# EAGLE design home_alarm_revB (EAGLE 9.5.1)
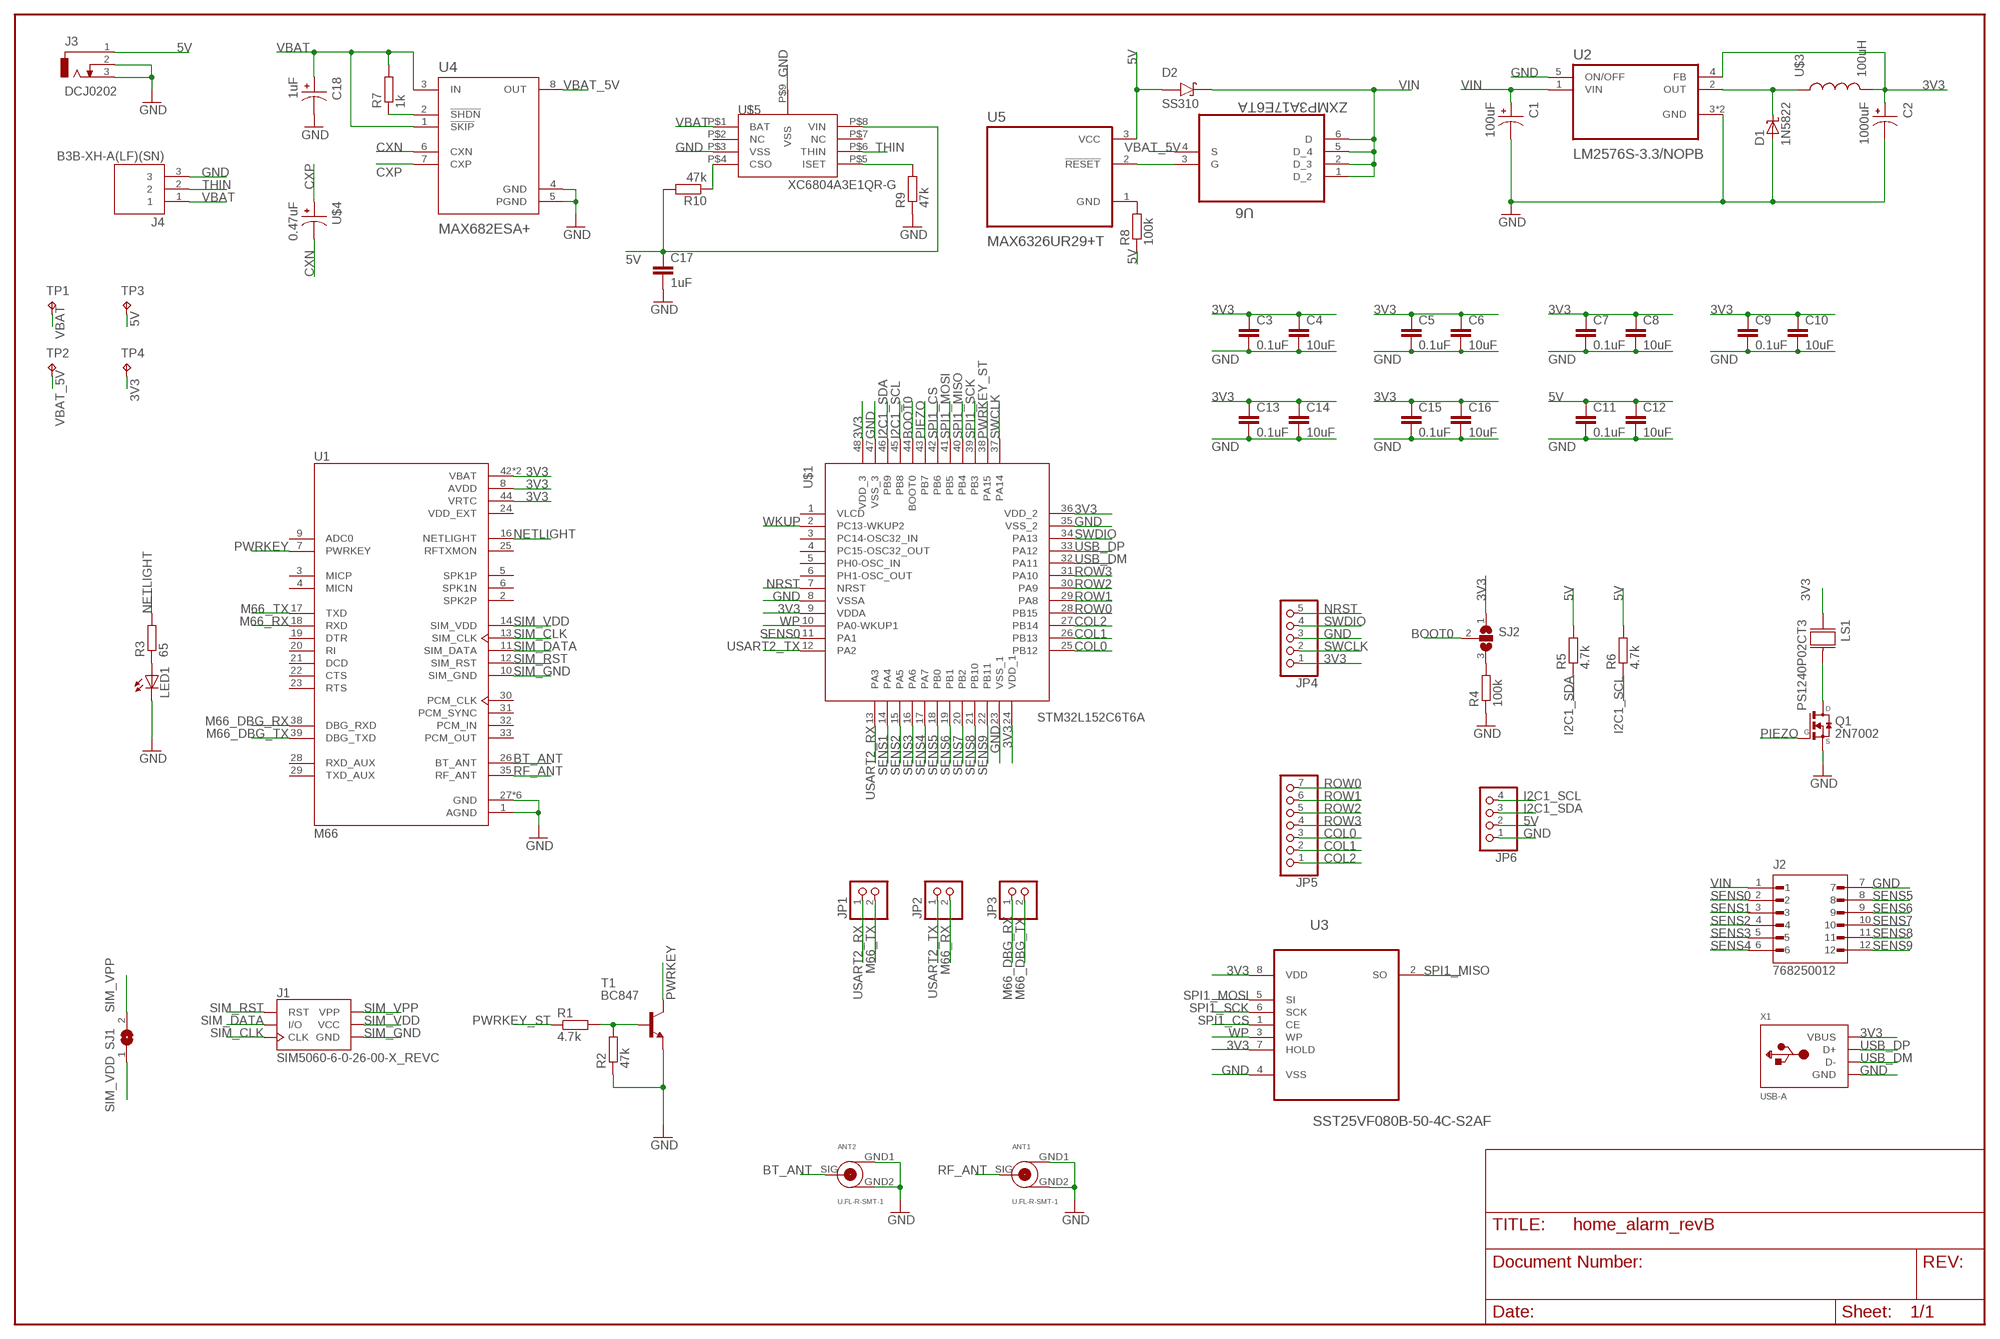
[diagram p0: schematic, sheet 1]

## Parts
ANT1  U.FL-R-SMT-1  [U.FL-R-SMT-1]
ANT2  U.FL-R-SMT-1  [U.FL-R-SMT-1]
C1  100uF  EEEFP1C101AV  [CAP_EEEFP1C101AV]
C2  1000uF  EEEFK1C102SV  [CAP_EEEFK1C102SV]
C3  0.1uF  C-EUC0805  [C0805]
C4  10uF  C-EUC0805  [C0805]
C5  0.1uF  C-EUC0805  [C0805]
C6  10uF  C-EUC0805  [C0805]
C7  0.1uF  C-EUC0805  [C0805]
C8  10uF  C-EUC0805  [C0805]
C9  0.1uF  C-EUC0805  [C0805]
C10  10uF  C-EUC0805  [C0805]
C11  0.1uF  C-EUC0805  [C0805]
C12  10uF  C-EUC0805  [C0805]
C13  0.1uF  C-EUC0805  [C0805]
C14  10uF  C-EUC0805  [C0805]
C15  0.1uF  C-EUC0805  [C0805]
C16  10uF  C-EUC0805  [C0805]
C17  1uF  C-EUC0805  [C0805]
C18  1uF  EEE1HA010NR  [CAP_EEE1HA010NR]
D1  1N5822  [DIOAD2120W130L950D530P]
D2  SS310  [DIOM6859X262N]
J1  SIM5060-6-0-26-00-X_REVC  [GCT_SIM5060-6-0-26-00-X_REVC]
J2  768250012  [MOLEX_768250012]
J3  DCJ0202  [DCJ0202]
J4  B3B-XH-A(LF)(SN)  [JST_B3B-XH-A(LF)(SN)]
JP1  PINHD-1X2  [1X02]
JP2  PINHD-1X2  [1X02]
JP3  PINHD-1X2  [1X02]
JP4  PINHD-1X5  [1X05]
JP5  PINHD-1X7  [1X07]
JP6  PINHD-1X4  [1X04]
LED1  LEDCHIPLED_0603  [CHIPLED_0603]
LS1  PS1240P02CT3  [XDCR_PS1240P02CT3]
Q1  2N7002  [SOT23]
R1  4.7k  R-EU_R0805  [R0805]
R2  47k  R-EU_R0805  [R0805]
R3  65  R-EU_R0805  [R0805]
R4  100k  R-EU_R0805  [R0805]
R5  4.7k  R-EU_R0805  [R0805]
R6  4.7k  R-EU_R0805  [R0805]
R7  1k  R-EU_R0805  [R0805]
R8  100k  R-EU_R0805  [R0805]
R9  47k  R-EU_R0805  [R0805]
R10  47k  R-EU_R0805  [R0805]
SJ1  SJ  [SJ]
SJ2  SJ2W  [SJ_2]
T1  BC847  [SOT23]
TP1  TPB1,27  [B1,27]
TP2  TPB1,27  [B1,27]
TP3  TPB1,27  [B1,27]
TP4  TPB1,27  [B1,27]
U1  M66  [XCVR_M66]
U2  LM2576S-3.3/NOPB  [VREG_TPS79625KTTR]
U3  SST25VF080B-50-4C-S2AF  [SOIC127P790X216-8N]
U4  MAX682ESA+  [SOIC127P600X175-8N]
U5  MAX6326UR29+T  [SOT95P237X112-3N]
U6  ZXMP3A17E6TA  [SOT95P280X145-6N]
U$1  STM32L152C6T6A  [STM32L152C6T6A]
U$3  100uH  MSS1210-104KED  [MSS1210-104KED]
U$4  0.47uF  865230640004  [865230640004]
U$5  XC6804A3E1QR-G  [XC6804A3E1QR-G]
X1  USB-A  [MOLEX_480371000]

## Nets
3V3: C2.1 C3.1 C4.1 C5.1 C6.1 C7.1 C8.1 C9.1 C10.1 C13.1 C14.1 C15.1 C16.1 JP4.1 LS1.1 SJ2.1 TP4.TP U1.8(AVDD) U1.42(VBAT) U1.43(VBAT) U1.44(VRTC) U2.4(FB) U3.7(HOLD) U3.8(VDD) U$1.9(VDDA) U$1.24(VDD_1) U$1.36(VDD_2) U$1.48(VDD_3) U$3.P$2 X1.1(VBUS)
5V: C11.1 C12.1 C17.1 D2.A J3.1 JP6.2 R5.2 R6.2 R8.1 R10.2 TP3.TP U5.3(VCC) U$5.P$8(VIN)
BOOT0: SJ2.2 U$1.44(BOOT0)
BT_ANT: ANT2.SIG U1.26(BT_ANT)
COL0: JP5.3 U$1.25(PB12)
COL1: JP5.2 U$1.26(PB13)
COL2: JP5.1 U$1.27(PB14)
CXN: U4.6(CXN) U$4.2
CXP: U4.7(CXP) U$4.1
GND: ANT1.GND1 ANT1.GND2 ANT2.GND1 ANT2.GND2 C1.2 C2.2 C3.2 C4.2 C5.2 C6.2 C7.2 C8.2 C9.2 C10.2 C11.2 C12.2 C13.2 C14.2 C15.2 C16.2 C17.2 C18.2 D1.A J2.7 J3.2 J3.3 J4.3 JP4.3 JP6.1 LED1.C Q1.2(S) R2.1 R4.1 R9.1 T1.2(E) U1.1(AGND) U1.27(GND) U1.34(GND) U1.36(GND) U1.37(GND) U1.40(GND) U1.41(GND) U2.3(GND) U2.5(ON/OFF) U2.6(GND) U3.4(VSS) U4.4(GND) U4.5(PGND) U$1.8(VSSA) U$1.23(VSS_1) U$1.35(VSS_2) U$1.47(VSS_3) U$5.P$3(VSS) U$5.P$9(VSS) X1.4(GND)
I2C1_SCL: JP6.4 R6.1 U$1.45(PB8)
I2C1_SDA: JP6.3 R5.1 U$1.46(PB9)
M66_DBG_RX: JP3.1 U1.38(DBG_RXD)
M66_DBG_TX: JP3.2 U1.39(DBG_TXD)
M66_RX: JP2.2 U1.18(RXD)
M66_TX: JP1.2 U1.17(TXD)
N$1: LS1.2 Q1.3(D)
N$2: R7.1 U4.2(!SHDN)
N$3: R8.2 U5.1(GND)
N$4: R9.2 U$5.P$5(ISET)
N$5: U5.2(!RESET) U6.3(G)
N$6: R10.1 U$5.P$4(CSO)
N$28: D1.C U2.2(OUT) U$3.P$1
N$29: R1.2 R2.2 T1.1(B)
N$30: LED1.A R3.1
N$33: R4.2 SJ2.3
NETLIGHT: R3.2 U1.16(NETLIGHT)
NRST: JP4.5 U$1.7(NRST)
PIEZO: Q1.1(G) U$1.43(PB7)
PWRKEY: T1.3(C) U1.7(PWRKEY)
PWRKEY_ST: R1.1 U$1.38(PA15)
RF_ANT: ANT1.SIG U1.35(RF_ANT)
ROW0: JP5.7 U$1.28(PB15)
ROW1: JP5.6 U$1.29(PA8)
ROW2: JP5.5 U$1.30(PA9)
ROW3: JP5.4 U$1.31(PA10)
SENS0: J2.2 U$1.11(PA1)
SENS1: J2.3 U$1.14(PA4)
SENS2: J2.4 U$1.15(PA5)
SENS3: J2.5 U$1.16(PA6)
SENS4: J2.6 U$1.17(PA7)
SENS5: J2.8 U$1.18(PB0)
SENS6: J2.9 U$1.19(PB1)
SENS7: J2.10 U$1.20(PB2)
SENS8: J2.11 U$1.21(PB10)
SENS9: J2.12 U$1.22(PB11)
SIM_CLK: J1.C3(CLK) U1.13(SIM_CLK)
SIM_DATA: J1.C7(I/O) U1.11(SIM_DATA)
SIM_GND: J1.C5(GND) U1.10(SIM_GND)
SIM_RST: J1.C2(RST) U1.12(SIM_RST)
SIM_VDD: J1.C1(VCC) SJ1.1 U1.14(SIM_VDD)
SIM_VPP: J1.C6(VPP) SJ1.2
SPI1_CS: U3.1(CE) U$1.42(PB6)
SPI1_MISO: U3.2(SO) U$1.40(PB4)
SPI1_MOSI: U3.5(SI) U$1.41(PB5)
SPI1_SCK: U3.6(SCK) U$1.39(PB3)
SWCLK: JP4.2 U$1.37(PA14)
SWDIO: JP4.4 U$1.34(PA13)
THIN: J4.2 U$5.P$6(THIN)
USART2_RX: JP1.1 U$1.13(PA3)
USART2_TX: JP2.1 U$1.12(PA2)
USB_DM: U$1.32(PA11) X1.2(D-)
USB_DP: U$1.33(PA12) X1.3(D+)
VBAT: C18.1 J4.1 R7.2 TP1.TP U4.1(!SKIP) U4.3(IN) U$5.P$1(BAT)
VBAT_5V: TP2.TP U4.8(OUT) U6.4(S)
VIN: C1.1 D2.C(K) J2.1 U2.1(VIN) U6.1(D_2) U6.2(D_3) U6.5(D_4) U6.6(D)
WKUP: U$1.2(PC13-WKUP2)
WP: U3.3(WP) U$1.10(PA0-WKUP1)
Unconnected: U1.2(SPK2P) U1.3(MICP) U1.4(MICN) U1.5(SPK1P) U1.6(SPK1N) U1.9(ADC0) U1.19(DTR) U1.20(RI) U1.21(DCD) U1.22(CTS) U1.23(RTS) U1.25(RFTXMON) U1.28(RXD_AUX) U1.29(TXD_AUX) U1.30(PCM_CLK) U1.31(PCM_SYNC) U1.32(PCM_IN) U1.33(PCM_OUT) U$1.1(VLCD) U$1.3(PC14-OSC32_IN) U$1.4(PC15-OSC32_OUT) U$1.5(PH0-OSC_IN) U$1.6(PH1-OSC_OUT) U$5.P$2(NC) U$5.P$7(NC)

## Power pins joined to a net without a drawn wire
VDD_EXT: U1.24(VDD_EXT)

## Library data of the parts
ANT1 ANT2 = U.FL-R-SMT-1:U.FL-R-SMT-1: U.FL (UMCC) Connector Receptacle, Male Pin 50Ohm Surface Mount Solder Check prices; AVAILABILITY: In Stock; DESCRIPTION: U.FL-R-SMT(10) Hirose Electric RF Connectors U.FL 0Hz to 6GHz 50Ohm Solder ST SMD F Gold T/R - Arrow.com; MF: Hirose Electric Co Ltd; MP: U.FL-R-SMT-1; PACKAGE: None; PRICE: None; PURCHASE-URL: https://pricing.snapeda.com/search/part/U.FL-R-SMT-1/?ref=eda
C1 = EEEFP1C101AV:EEEFP1C101AV: Check availability; AVAILABILITY: In Stock; DESCRIPTION: CAP ALUM 100UF 20% 16V SMD; MF: Panasonic; MP: EEEFP1C101AV; PACKAGE: RADIAL-2 Panasonic; PRICE: None; PURCHASE-URL: https://pricing.snapeda.com/search/part/EEEFP1C101AV/?ref=eda
C2 = EEEFK1C102SV:EEEFK1C102SV: Check availability; AVAILABILITY: In Stock; DESCRIPTION: CAP ALUM 1000UF 20% 16V SMD; MF: Panasonic; MP: EEEFK1C102SV; PACKAGE: RADIAL-2 Panasonic; PRICE: None; PURCHASE-URL: https://pricing.snapeda.com/search/part/EEEFK1C102SV/?ref=eda
C3-C17 = rcl:C-EU: CAPACITOR, European symbol; SPICEPREFIX: C
C18 = EEE1HA010NR:EEE1HA010NR: Check availability; AVAILABILITY: In Stock; DESCRIPTION: 1µF 50V Aluminum Electrolytic Capacitors Radial, Can - SMD 2000 Hrs @ 85°C; MF: Panasonic Electronic; MP: EEE-1HA010NR; PACKAGE: RADIAL-2 Panasonic; PRICE: None; PURCHASE-URL: https://pricing.snapeda.com/search/part/EEE-1HA010NR/?ref=eda
D1 = 1N5822:1N5822: 1N5822 Series 40 V 3 A Through Hole Schottky Rectifier - DO-201AD Check availability; AVAILABILITY: In Stock; DESCRIPTION: Diode Schottky 40V 3A 2-Pin DO-201AD T/R; MF: EIC; MP: 1N5822; PACKAGE: DO-201AD-201 EIC; PRICE: None; PURCHASE-URL: https://pricing.snapeda.com/search/part/1N5822/?ref=eda
D2 = SS310:SS310: Check availability; AVAILABILITY: In Stock; DESCRIPTION: 3A, 100V, Schottky Rectifier; MF: Taiwan Semiconductor; MP: SS310; PACKAGE: SMC-2 Taiwan Semiconductor; PRICE: None; PURCHASE-URL: https://pricing.snapeda.com/search/part/SS310/?ref=eda
J1 = SIM5060-6-0-26-00-X_REVC:SIM5060-6-0-26-00-X_REVC: SIM Card Connector, Hinged Type, 6 Pin, SMT, 2.6mm Profile, Optional Locating Post Check availability; AVAILABILITY: In Stock; DESCRIPTION: 6 Position Card Connector Mini SIM Surface Mount, Right Angle Gold; MF: Global Connector Technology; MP: SIM5060-6-0-26-00-A; PACKAGE: None; PRICE: None; PURCHASE-URL: https://pricing.snapeda.com/search/part/SIM5060-6-0-26-00-A/?ref=eda
J2 = 768250012:768250012: Check availability; AVAILABILITY: In Stock; DESCRIPTION: Conn Power HDR 12 POS 5.7mm Solder RA Thru-Hole 12 Terminal 1 Port Mega-Fit? Tray; MF: Molex; MP: 76825-0012; PACKAGE: None; PRICE: None; PURCHASE-URL: https://pricing.snapeda.com/search/part/76825-0012/?ref=eda
J3 = con-jack:DCJ0202: DC POWER JACK Source: DCJ0202.pdf; OC_FARNELL: unknown; OC_NEWARK: unknown
J4 = B3B-XH-A_LF__SN_:B3B-XH-A(LF)(SN): Connector Header Through Hole 3 position 0.098" (2.50mm) Check prices Check availability; AVAILABILITY: In Stock; DESCRIPTION: Connector Header Through Hole 3 position 0.098 (2.50mm); MF: JST Sales; MP: B3B-XH-A(LF)(SN); PACKAGE: None; PRICE: None
JP1-JP3 = pinhead:PINHD-1X2: PIN HEADER
JP4 = pinhead:PINHD-1X5: PIN HEADER
JP5 = pinhead:PINHD-1X7: PIN HEADER
JP6 = pinhead:PINHD-1X4: PIN HEADER
LED1 = adafruit:LED: LED OSRAM: - CHIPLED LG R971, LG N971, LY N971, LG Q971, LY Q971, LO R971, LY R971 LH N974, LH R974 LS Q976, LO Q976, LY Q976 LO Q996 - Hyper CHIPLED LW Q18S LB Q993, LB Q99A, LB R99A - SideLED LS A670, LO A670, LY A670, LG A670, LP A670 LB A673, LV A673, LT A673, LW A673 LH A674 LY A675 LS A676, LA A676, LO A676, LY A676, LW A676 LS A679, LY A679, LG A679 - Hyper Micro SIDELED® LS Y876, LA Y876, LO Y876, LY Y876 LT Y87S - SmartLED LW L88C, LW L88S LB L89C, LB L89S, LG L890 LS L89K, LO L89K, LY L89K LS L896, LA L896, LO L896, LY L896 - TOPLED LS T670, LO T670, LY T670, LG T670, LP T670 LSG T670, LSP T670, LSY T670, LOP T670, LYG T670 LG T671, LOG T671, LSG T671 LB T673, LV T673, LT T673, LW T673 LH T674 LS T676, LA T676, LO T676, LY T676, LB T676, LH T676, LSB T676, LW T676 LB T67C, LV T67C, LT T67C, LS T67K, LO T67K, LY T67K, LW E67C LS E67B, LA E67B, LO E67B, LY E67B, LB E67C, LV E67C, LT E67C LW T67C LS T679, LY T679, LG T679 LS T770, LO T770, LY T770, LG T770, LP T770 LB T773, LV T773, LT T773, LW T773 LH T774 LS E675, LA E675, LY E675, LS T675 LS T776, LA T776, LO T776, LY T776, LB T776 LHGB T686 LT T68C, LB T68C - Hyper Mini TOPLED® LB M676 - Mini TOPLED Santana® LG M470 LS M47K, LO M47K, LY M47K Source: http://www.osram.convergy.de/
LS1 = PS1240P02CT3:PS1240P02CT3: Buzzers Transducer, Externally Driven Piezo 3V 4kHz 60dB @ 3V, 10cm Through Hole PC Pins Check availability; AVAILABILITY: In Stock; DESCRIPTION: Buzzers Transducer, Externally Driven Piezo 3 V - 4kHz 60dB @ 3V, 10cm Through Hole PC Pins; MF: TDK; MP: PS1240P02CT3; PACKAGE: None; PRICE: None; PURCHASE-URL: https://pricing.snapeda.com/search/part/PS1240P02CT3/?ref=eda
Q1 = 2N7002_:2N7002*: N-Channel MOSFET Check availability; AVAILABILITY: In Stock; DESCRIPTION: 2N7002 Series 60 V 7.5 Ohms N-Ch Enhancement Mode Field Effect Transistor SOT-23; MF: STMicroelectronics; MP: 2N-7002; PACKAGE: SOT-23-3 STMicroelectronics; PRICE: None
R1-R10 = resistor:R-EU_: RESISTOR, European symbol
SJ1 = jumper:SJ: SMD solder JUMPER
SJ2 = jumper:SJ2W: SMD solder JUMPER
T1 = transistor:BC847: NPN TRANSISTOR
TP1-TP4 = testpad:TP: Test pad
U1 = M66:M66: Quand Band Gsm/Gprs Module M66 R2.0 Check availability; AVAILABILITY: In Stock; DESCRIPTION: M66 is an ultra-small quad-band GSM/GPRS module using LCC castellation packaging on the market. Based on the latest 2G chipset, it has the optimal performance in SMS & Data transmission and audio service even in harsh environment.; MF: Quectel; MP: M66; PACKAGE: SMD-52 Quectel; PRICE: None; PURCHASE-URL: https://pricing.snapeda.com/search/part/M66/?ref=eda
U2 = LM2576S-3.3_NOPB:LM2576S-3.3/NOPB: Check availability; AVAILABILITY: In Stock; DESCRIPTION: SIMPLE SWITCHER&reg; 40V, 3A Low Component Count Step-Down Regulator 5-DDPAK/TO-263 -40 to 125; MF: Texas Instruments; MP: LM2576S-3.3/NOPB; PACKAGE: TO-263-5 Texas Instruments; PRICE: None; PURCHASE-URL: https://pricing.snapeda.com/search/part/LM2576S-3.3/NOPB/?ref=eda
U3 = SST25VF080B-50-4C-S2AF:SST25VF080B-50-4C-S2AF: 8 Mbit SPI Serial Flash Check availability; AVAILABILITY: In Stock; DESCRIPTION: FLASH Memory IC 8Mb (1M x 8) SPI 50 MHz 8-SOIC; MF: Microchip; MP: SST25VF080B-50-4C-S2AF; PACKAGE: SOIC-8 Microchip; PRICE: None; PURCHASE-URL: https://pricing.snapeda.com/search/part/SST25VF080B-50-4C-S2AF/?ref=eda
U4 = MAX682ESA_:MAX682ESA+: None Check availability; AVAILABILITY: In Stock; DESCRIPTION: Charge Pump Switching Regulator IC Positive Fixed 5V 1 Output 250mA 8-SOIC (0.154, 3.90mm Width); MF: Maxim Integrated; MP: MAX682ESA+; PACKAGE: SOIC-8 Maxim; PRICE: None; PURCHASE-URL: https://pricing.snapeda.com/search/part/MAX682ESA+/?ref=eda
U5 = MAX6326UR29_T:MAX6326UR29+T: Check availability; AVAILABILITY: In Stock; DESCRIPTION: Supervisor Push-Pull, Totem Pole 1 Channel SOT-23-3; MF: Maxim Integrated; MP: MAX6326UR29+T; PACKAGE: SOT-23-3 Maxim Integrated; PRICE: None; PURCHASE-URL: https://pricing.snapeda.com/search/part/MAX6326UR29+T/?ref=eda
U6 = ZXMP3A17E6TA:ZXMP3A17E6TA: Enhancement mode P channel Mosfet Check availability; AVAILABILITY: In Stock; DESCRIPTION: P-Channel 30 V 3.2A (Ta) 1.1W (Ta) Surface Mount SOT-23-6; MF: Diodes Inc.; MP: ZXMP3A17E6TA; PACKAGE: SOT-23-6 Diodes Inc.; PRICE: None; PURCHASE-URL: https://pricing.snapeda.com/search/part/ZXMP3A17E6TA/?ref=eda
U$1 = STM32L152C6T6A:STM32L152C6T6A
U$3 = MSS1210-104KED:MSS1210-104KED
U$4 = 865230640004:865230640004
U$5 = XC6804A3E1QR-G:XC6804A3E1QR-G
X1 = adafruit:USB-A: USB type A 'plug' Used for things that can directly connect to a USB port, say USB key

## Board
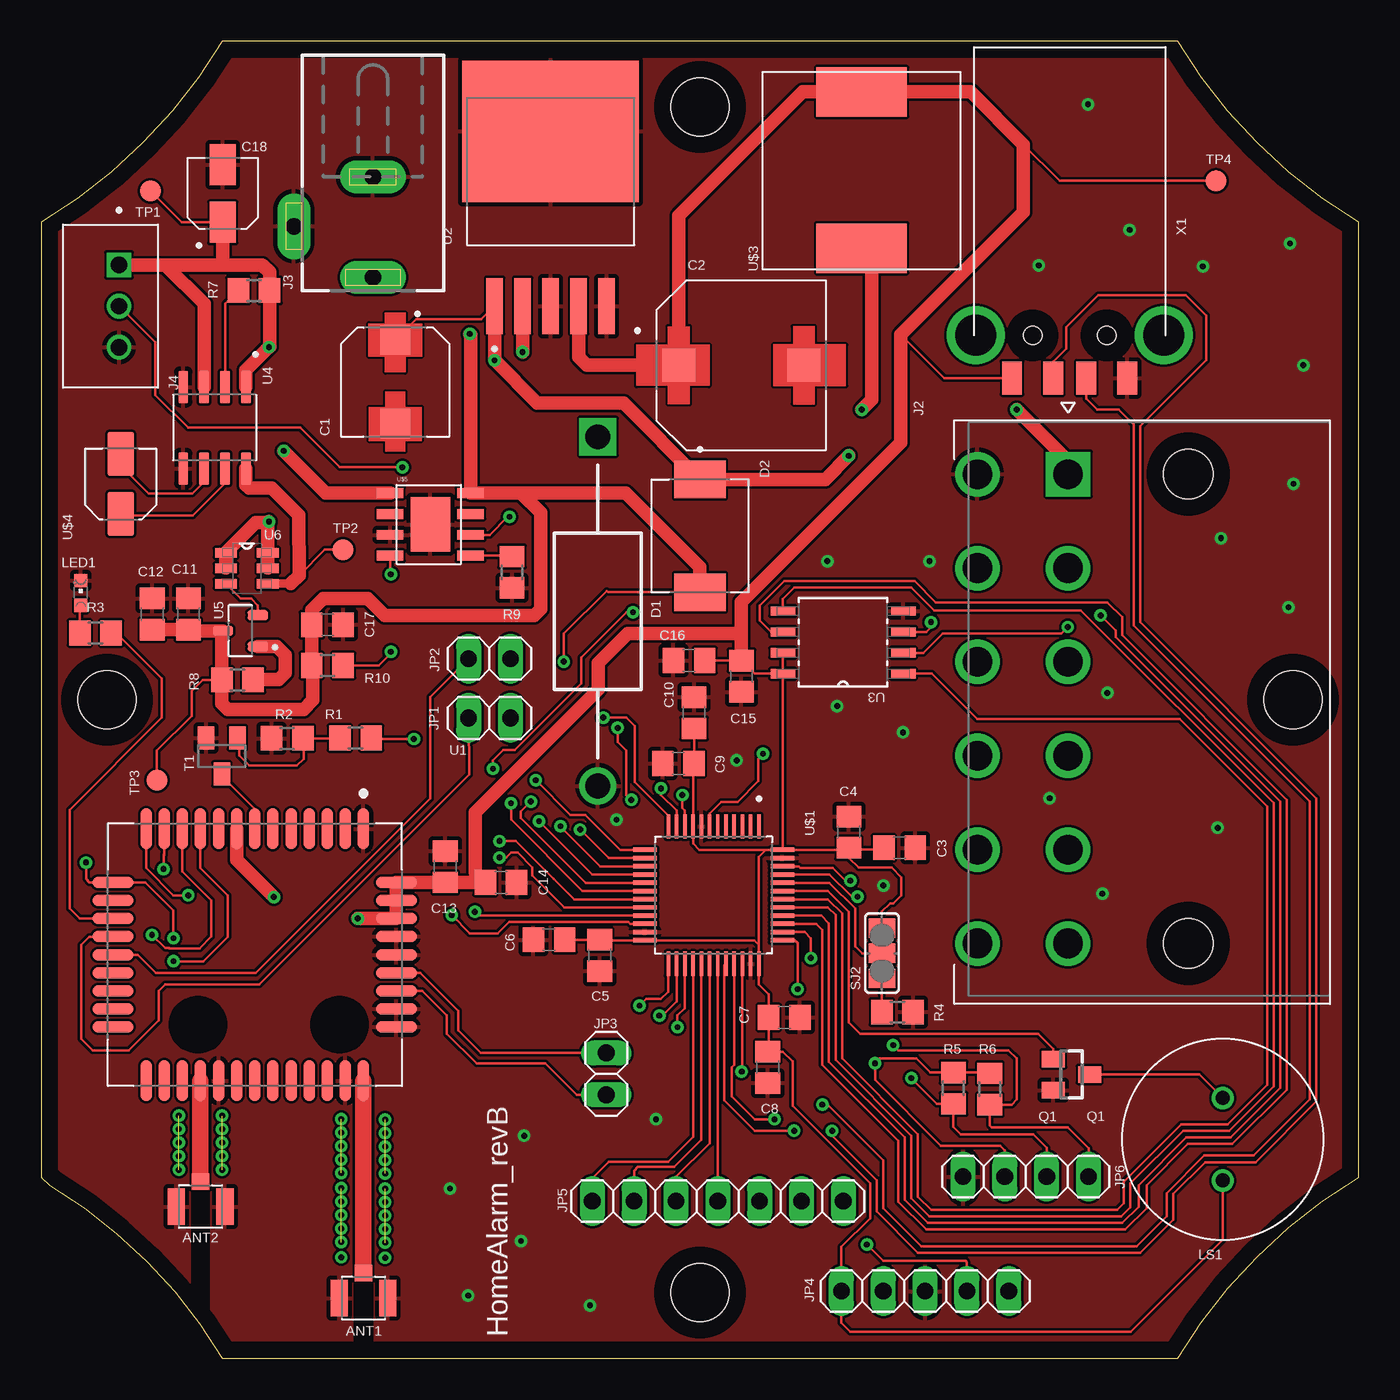
[diagram p1: board, top side]
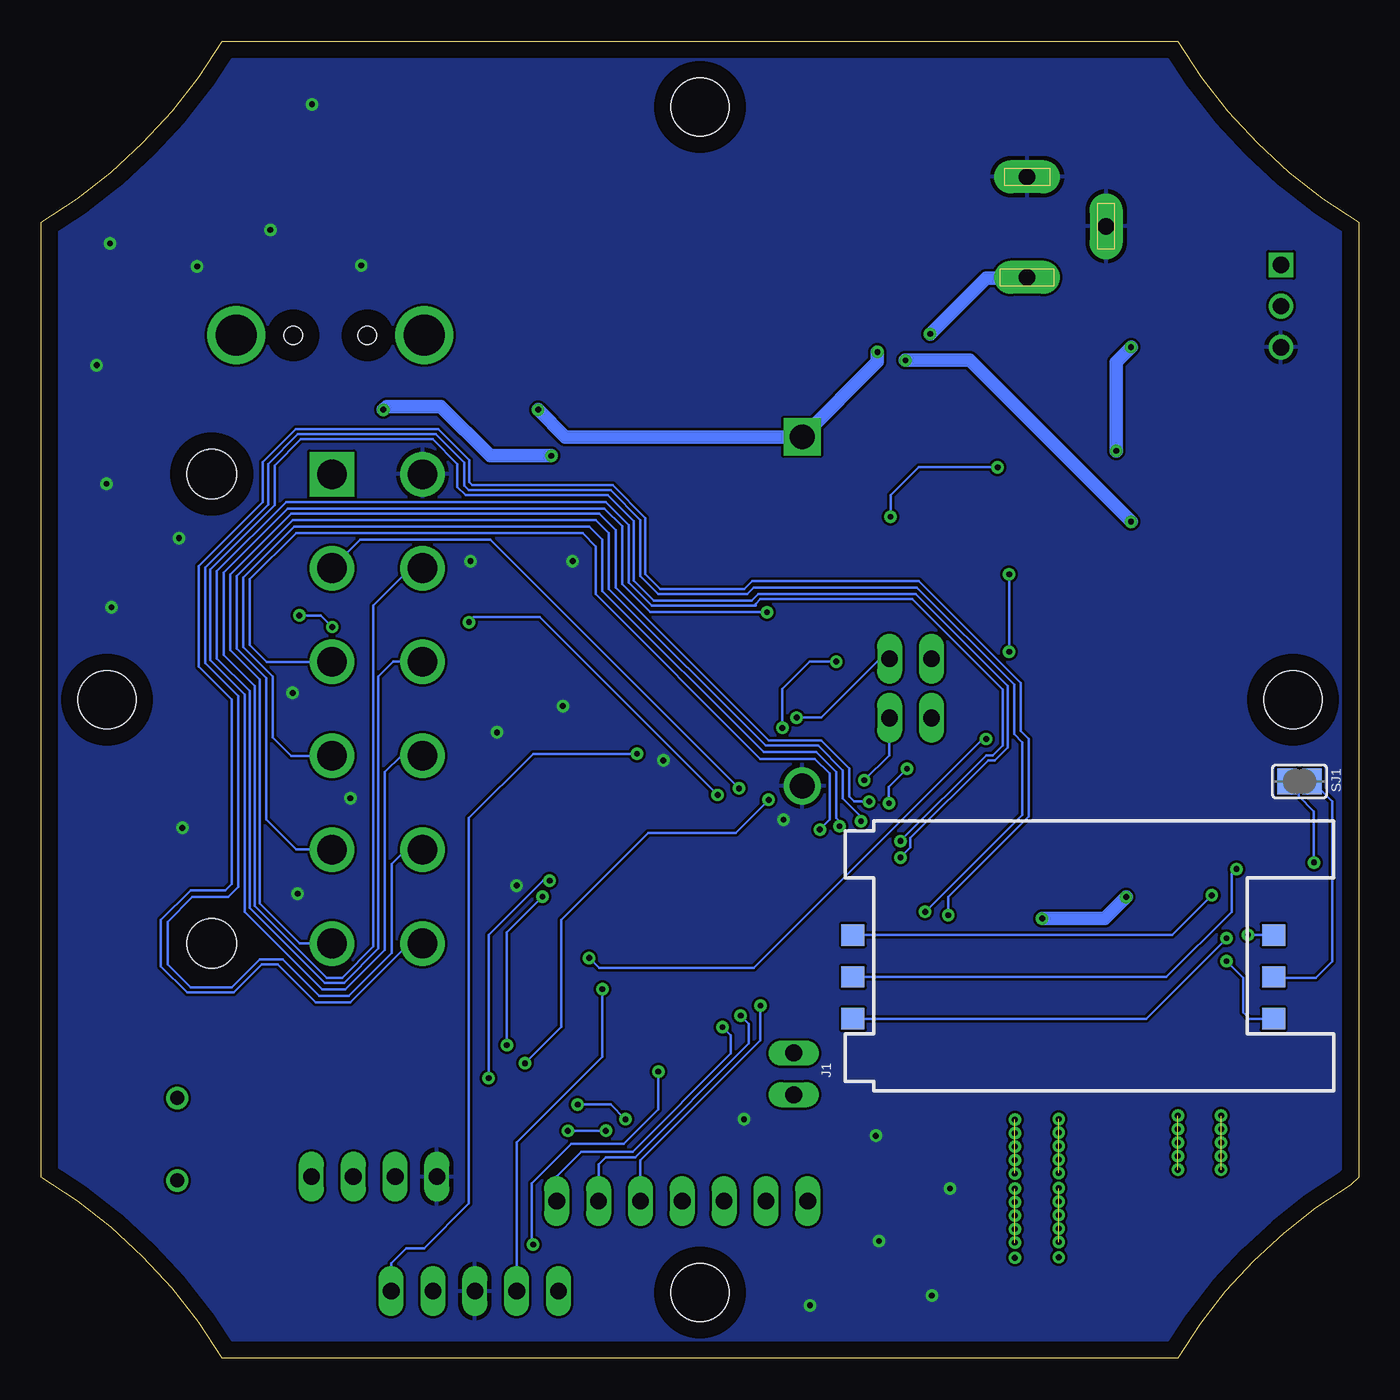
[diagram p2: board, bottom side, seen from below]

Size 80 x 80 mm. Coordinates in mm from the lower left corner, seen from the top.
Outline: 69,0 arc-28 80,11 80,69 arc-28 69,80 11,80 arc-28 0,69 0,11 0.52,10.5 arc-28 11,0 69,0
Copper layers (1*16): Top 0.035mm / dielectric 1.5mm / Bottom 0.035mm
Design rules "default": minimum track width 6mil, minimum drill 0.35mm, track to track 6mil, track to pad 6mil, pad to pad 6mil, via to via 6mil, smd to smd 6mil, copper to edge 40mil, drill to drill 6mil, minimum pad ring 10mil, minimum via ring 8mil, stop-mask expansion 4mil, vias tented up to drill 0mil, thermal gap 10mil
Holes 3.5 mm at 4,40 40,76 40,4 76,40

### Footprints (pad centres in the part's own frame; a part is rotated, then mirrored left to right if it is on the bottom)
U.FL-R-SMT-1 = smd 1.05 x 2.2: GND1 -1.475,0; GND2 1.475,0 | smd 1.05 x 1: SIG 0,-1.525
CAP_EEEFP1C101AV = smd 1.8 x 1.8: 1 -2.55,0; 2 2.55,0
CAP_EEEFK1C102SV = smd 2 x 2: 1 -3.8,0; 2 3.8,0
C0805 = smd 1.3 x 1.5: 1 -0.95,0; 2 0.95,0
CAP_EEE1HA010NR = smd 2.5 x 1.6: 1 -1.75,0; 2 1.75,0
DIOAD2120W130L950D530P = drill 1.5 pad 2.25: A 10.6,0 | drill 1.5 pad 2.25 square: C -10.6,0
DIOM6859X262N = smd 2.29 x 3.12: A 3.43,0; C -3.43,0
GCT_SIM5060-6-0-26-00-X_REVC = smd 1.3 x 1.4: C1 -3.81,12.77; C2 -1.27,12.77; C3 1.27,12.77; C5 -3.81,-12.77; C6 -1.27,-12.77; C7 1.27,-12.77
MOLEX_768250012 = drill 1.8 pad 2.3 square: 1 0,0 | drill 1.8 pad 2.3: 2 -5.7,0; 3 -11.4,0; 4 -17.1,0; 5 -22.8,0; 6 -28.5,0; 7 0,5.5; 8 -5.7,5.5; 9 -11.4,5.5; 10 -17.1,5.5; 11 -22.8,5.5; 12 -28.5,5.5 | hole 3: -28.5,-7.3; 0,-7.3
DCJ0202 = drill 1 pad 2 long: 1 0,3.1; 2 4.8,0; 3 0,-3
JST_B3B-XH-A(LF)(SN) = drill 1 square: 1 2.5,0 | drill 1: 2 0,0; 3 -2.5,0
1X02 = drill 1.016 long: 1 -1.27,0; 2 1.27,0
1X05 = drill 1.016 long: 1 -5.08,0; 2 -2.54,0; 3 0,0; 4 2.54,0; 5 5.08,0
1X07 = drill 1.016 long: 1 -7.62,0; 2 -5.08,0; 3 -2.54,0; 4 0,0; 5 2.54,0; 6 5.08,0; 7 7.62,0
1X04 = drill 1.016 long: 1 -3.81,0; 2 -1.27,0; 3 1.27,0; 4 3.81,0
CHIPLED_0603 = smd 0.8 x 0.8: A 0,-0.75; C 0,0.75
XDCR_PS1240P02CT3 = drill 0.85 pad 1.28: 1 -2.5,0; 2 2.5,0
SOT23 = smd 1 x 1.4: 1 -0.95,-1.1; 2 0.95,-1.1; 3 0,1.1
R0805 = smd 1.3 x 1.5: 1 -0.95,0; 2 0.95,0
SJ = smd 1.168 x 1.6: 1 -0.762,0; 2 0.762,0
SJ_2 = smd 1.168 x 1.6: 1 -1.524,0; 2 0,0; 3 1.524,0
B1,27 = smd 1.27 x 1.27: TP 0,0
XCVR_M66 = smd 2.5 x 0.7: 1 -7.65,6.6; 2 -7.65,5.5; 3 -7.65,4.4; 4 -7.65,3.3; 5 -7.65,2.2; 6 -7.65,1.1; 7 -7.65,0; 8 -7.65,-1.1; 9 -7.65,-2.2; 10 -7.65,-3.3; 11 -7.65,-4.4; 12 -7.65,-5.5; 13 -7.65,-6.6; 23 7.65,-6.6; 24 7.65,-5.5; 25 7.65,-4.4; 26 7.65,-3.3; 27 7.65,-2.2; 28 7.65,-1.1; 29 7.65,0; 30 7.65,1.1; 31 7.65,2.2; 32 7.65,3.3; 33 7.65,4.4; 34 7.65,5.5; 35 7.65,6.6 | smd 0.7 x 2.5: 14 -4.4,-8.6; 15 -3.3,-8.6; 16 -2.2,-8.6; 17 -1.1,-8.6; 18 0,-8.6; 19 1.1,-8.6; 20 2.2,-8.6; 21 3.3,-8.6; 22 4.4,-8.6; 36 4.4,8.6; 37 3.3,8.6; 38 2.2,8.6; 39 1.1,8.6; 40 0,8.6; 41 -1.1,8.6; 42 -2.2,8.6; 43 -3.3,8.6; 44 -4.4,8.6
VREG_TPS79625KTTR = smd 3.4 x 1: 1 -10.6,3.4; 2 -10.6,1.7; 3 -10.6,0; 4 -10.6,-1.7; 5 -10.6,-3.4 | smd 8.6 x 10.7: 6 0,0
SOIC127P790X216-8N = smd 1.499 x 0.559: 1 -3.658,1.905; 2 -3.658,0.635; 3 -3.658,-0.635; 4 -3.658,-1.905; 5 3.658,-1.905; 6 3.658,-0.635; 7 3.658,0.635; 8 3.658,1.905
SOIC127P600X175-8N = smd 1.97 x 0.59: 1 -2.475,1.905; 2 -2.475,0.635; 3 -2.475,-0.635; 4 -2.475,-1.905; 5 2.475,-1.905; 6 2.475,-0.635; 7 2.475,0.635; 8 2.475,1.905
SOT95P237X112-3N = smd 1.23 x 0.59: 1 -1.06,0.95; 2 -1.06,-0.95; 3 1.06,0
SOT95P280X145-6N = smd 1.321 x 0.559: 1 -1.27,0.94; 2 -1.27,0; 3 -1.27,-0.94; 4 1.27,-0.94; 5 1.27,0; 6 1.27,0.94
STM32L152C6T6A = smd 1.49 x 0.28: 1 -4.17,2.75; 2 -4.17,2.25; 3 -4.17,1.75; 4 -4.17,1.25; 5 -4.17,0.75; 6 -4.17,0.25; 7 -4.17,-0.25; 8 -4.17,-0.75; 9 -4.17,-1.25; 10 -4.17,-1.75; 11 -4.17,-2.25; 12 -4.17,-2.75; 25 4.17,-2.75; 26 4.17,-2.25; 27 4.17,-1.75; 28 4.17,-1.25; 29 4.17,-0.75; 30 4.17,-0.25; 31 4.17,0.25; 32 4.17,0.75; 33 4.17,1.25; 34 4.17,1.75; 35 4.17,2.25; 36 4.17,2.75 | smd 0.28 x 1.49: 13 -2.75,-4.17; 14 -2.25,-4.17; 15 -1.75,-4.17; 16 -1.25,-4.17; 17 -0.75,-4.17; 18 -0.25,-4.17; 19 0.25,-4.17; 20 0.75,-4.17; 21 1.25,-4.17; 22 1.75,-4.17; 23 2.25,-4.17; 24 2.75,-4.17; 37 2.75,4.17; 38 2.25,4.17; 39 1.75,4.17; 40 1.25,4.17; 41 0.75,4.17; 42 0.25,4.17; 43 -0.25,4.17; 44 -0.75,4.17; 45 -1.25,4.17; 46 -1.75,4.17; 47 -2.25,4.17; 48 -2.75,4.17
MSS1210-104KED = smd 5.5 x 3: P$1 0.3,4.21; P$2 0.3,-5.29
865230640004 = smd 2.66 x 1.58: 1 -1.825,0; 2 1.825,0
XC6804A3E1QR-G = smd 1.62 x 0.6: P$1 -2.5,1.81; P$2 -2.5,0.54; P$3 -2.5,-0.73; P$4 -2.5,-2; P$5 2.38,-2; P$6 2.38,-0.73; P$7 2.38,0.54; P$8 2.38,1.81 | smd 2.4 x 3.3: P$9 -0.055,-0.1
MOLEX_480371000 = smd 1.2 x 2: 1 3.5,2.6; 2 1,2.6; 3 -1,2.6; 4 -3.5,2.6 | drill 2.5: M1 -5.7,0; M2 5.7,0 | hole 1.1: -2.25,0; 2.25,0

### Placement (x,y rotation side)
ANT1  19.57,3.66 180 top
ANT2  9.68,9.22 180 top
C1  21.5,59.3 270 top
C2  42.51,60.32 0 top
C3  52.12,31.01 0 top
C4  49.04,31.96 90 top
C5  33.92,24.48 270 top
C6  30.84,25.43 180 top
C7  45.12,20.71 0 top
C8  44.12,17.68 270 top
C9  38.69,36.13 180 top
C10  39.64,39.21 90 top
C11  8.94,45.21 90 top
C12  6.74,45.21 90 top
C13  24.54,29.86 90 top
C14  27.92,28.91 0 top
C15  42.52,41.43 270 top
C16  39.34,42.38 180 top
C17  17.38,44.56 0 top
C18  11.03,70.75 90 top
D1  33.8,45.37 270 top
D2  40,49.96 270 top
J1  17.95,24.44 90 bottom
J2  62.35,53.7 90 top
J3  20.14,68.76 180 top
J4  4.73,63.91 90 top
JP1  27.22,38.9 180 top
JP2  27.22,42.5 180 top
JP3  34.31,17.28 90 top
JP4  53.67,4.09 0 top
JP5  41.08,9.55 180 top
JP6  59.78,11.04 0 top
LED1  2.41,46.49 0 top
LS1  71.74,13.31 90 top
Q1  62.56,17.24 270 top
R1  19.09,37.68 180 top
R2  14.94,37.66 0 top
R3  3.3,44.06 0 top
R4  51.99,21.03 180 top
R5  55.39,16.41 90 top
R6  57.59,16.36 90 top
R7  12.92,64.86 0 top
R8  11.92,41.21 0 top
R9  28.59,47.75 90 top
R10  17.38,42.08 180 top
SJ1  3.6,35.04 0 bottom
SJ2  51.05,24.61 270 top
T1  10.97,36.59 180 top
TP1  6.63,70.92 0 top
TP2  18.33,49.12 0 top
TP3  7.03,35.12 0 top
TP4  71.33,71.52 0 top
U1  12.97,24.52 270 top
U2  30.93,74.52 90 top
U3  48.69,43.49 180 top
U4  10.53,56.53 270 top
U5  12.1,44.19 180 top
U6  12.49,47.99 0 top
U$1  40.83,28.14 270 top
U$3  50.11,71.63 180 top
U$4  4.83,53.11 90 top
U$5  23.69,50.75 0 top
X1  62.45,62.14 180 top

### Tracks (layer width: path | path; a pad name or v marks a point on that pad's centre or on a via)
3V3  (via drill 0.35)
  Top 0.152: C10.1 C9.1 39.58,36.07 U$1.9 39.58,31.27 39.96,30.89 44,30.89 | U$1.48 48.92,30.89 C4.1 | C4.1 49.18,30.87 49.18,30.97 49.24,30.91 51.07,30.91 C3.1 | C6.1 C5.1 33.96,25.39 U$1.24 43.31,25.39 43.58,25.12 | U3.8 43.31,41.58 C15.1 C16.1 | 26.63,28.91 C14.1 | X1.1 54.84,59.54 52.19,62.18 | U3.8 45.03,30.92 U$1.48 | 43.58,25.12 U$1.36 43.58,22.7 44.17,22.11 C7.1 44.17,18.68 C8.1 45.02,18.63 45.62,18.03 45.62,15.33 50.33,10.62 50.33,8.52 48.59,6.78 JP4.1 48.59,2.16 49.13,1.62 66.15,1.62 71.74,7.21 LS1.1 | 43.58,25.12 43.58,30.47 44,30.89 | 44,30.89 U$1.48 | SJ2.1 51.05,27.13 51.55,27.63 51.74,27.63 52.23,28.12 52.23,29.22 51.63,29.82 49.63,29.82 49.04,30.41 C4.1 | U3.8 U3.7 | TP4.TP 61.83,71.52 59.63,73.72
  Top 0.813: U2.4 32.63,60.82 33.13,60.32 C2.1 38.71,69.4 46.23,76.92 U$3.P$2 56.43,76.92 59.63,73.72 59.63,69.62 52.19,62.18 52.19,55.62 42.52,45.94 42.52,44.02 | 42.52,44.02 C15.1 | 26.63,28.91 C13.1 U1.44 U1.43 U1.42 v19.23,26.72 | C14.1 26.37,29.51 26.37,33.16 33.83,40.62 33.83,42.22 35.63,44.02 42.52,44.02 | U1.8 11.87,30.28 v14.13,28.02
  Bottom 0.813: v14.13,28.02 15.43,26.72 v19.23,26.72
5V  (via drill 0.35)
  Top 0.152: R6.2 57.54,17.36 R5.2 53.99,17.36 53.13,18.22 50.93,18.22 v50.63,17.92 50.63,16.92 54.63,12.92 58.23,12.92 58.51,12.64 JP6.2 | D2.A 34.42,46.53 34.33,46.62 31.73,44.02 v31.73,42.32 | v35.83,33.92 35.53,34.22 35.53,36.92 35,37.45 v35,38.29 | TP3.TP 7.03,36.92 9.13,39.02 9.13,40.52 9.82,41.21 R8.1
  Top 0.813: 29.13,52.56 U$5.P$8 26.07,62.18 v26.03,62.22 | 29.13,52.56 35.49,52.56 40,48.05 D2.A | 29.13,52.56 30.33,51.36 30.33,45.52 29.93,45.12 20.87,45.12 19.83,46.16 17.13,46.16 16.43,45.46 C17.1 R10.2 16.49,42.02 16.49,39.98 15.93,39.42 11.33,39.42 10.97,39.78 R8.1 10.97,44.12 U5.3 9.01,44.19 C11.1 C12.1
  Bottom 0.152: v50.63,17.92 48.43,20.12 48.43,26.62 43.13,31.92 37.83,31.92 v35.83,33.92 | v35,38.29 35,40.65 33.33,42.32 v31.73,42.32
  Bottom 0.813: v26.03,62.22 22.63,65.62 20.14,65.62 J3.1
BOOT0
  Top 0.152: U$1.44 47.86,28.89 49.43,27.32 49.43,25.02 49.84,24.61 SJ2.2
BT_ANT
  Top 0.61: 9.67,10.75 ANT2.SIG
  Top 1.016: U1.26 9.67,10.75
COL0  (via drill 0.35)
  Top 0.152: U$1.25 38.08,22.27 37.63,21.82 36.73,21.82 v36.33,21.42
  Bottom 0.152: v36.33,21.42 36.33,19.32 43.62,12.03 JP5.3
COL1  (via drill 0.35)
  Top 0.152: U$1.26 38.58,21.67 37.73,20.82 v37.53,20.82
  Bottom 0.152: v37.53,20.82 37.03,20.32 37.03,19.12 43.93,12.22 45.73,12.22 46.16,11.79 JP5.2
COL2  (via drill 0.35)
  Top 0.152: U$1.27 39.08,21.27 38.63,20.82 v38.63,20.12
  Bottom 0.152: JP5.1 48.7,11.05 47.2,12.55 44.1,12.55 38.13,18.52 38.13,19.62 v38.63,20.12
CXN
  Top 0.152: U$4.2 4.83,54.23 6.53,52.53 9.18,52.53 9.89,53.24 U4.6
CXP
  Top 0.152: U$4.1 4.93,51.18 9.19,51.18 11.16,53.15 U4.7
GND  (via drill 0.35)
  other vias: 51.13,28.72 42.23,36.32 61.23,34.02 64.73,40.42 64.43,28.22 52.33,38.02 48.33,39.62 29.13,7.12 24.83,10.32 25.93,3.82 29.33,13.52 33.33,3.22 34.93,32.72 47.73,48.42 53.93,48.42 70.53,66.32 75.83,67.72 76.63,60.32 71.63,49.82 76.03,53.12 75.73,45.62 71.43,32.22 37.33,14.52 63.56,76.17 60.57,66.39 66.09,68.54
  pour Top: -0.87,-1.88 -0.87,81.12 81.63,81.12 81.63,-1.88 20.22,-1.88 20.22,15.33 18.93,15.33 18.93,-1.88 10.3,-1.88 10.3,15.12 9.06,15.12 9.06,-1.88
  pour Bottom: -0.87,81.12 -0.87,-2.08 81.63,-2.08 81.63,81.12
I2C1_SCL  (via drill 0.35)
  Top 0.152: JP6.4 63.59,12.76 62.33,14.02 57.73,14.02 57.59,14.16 R6.1 58.92,15.41 59.23,15.72 59.23,18.22 58.73,18.72 52.03,18.72 v51.73,19.02 | U$1.45 47.86,29.39 49.2,28.05 v49.56,28.05
  Bottom 0.152: v49.56,28.05 51.73,25.88 v51.73,19.02
I2C1_SDA  (via drill 0.35)
  Top 0.152: U$1.46 46,29.89 46.1,29.79 48.06,29.79 48.83,29.02 v49.13,29.02 | v52.83,17.02 54.39,15.46 R5.1 55.39,14.06 55.83,13.62 60.23,13.62 61.05,12.8 JP6.3
  Bottom 0.152: v49.13,29.02 49.53,29.02 52.83,25.72 v52.83,17.02
M66_DBG_RX
  Top 0.152: U1.38 23.13,22.32 24.63,20.82 24.63,19.72 26.44,17.91 30.61,17.91 32.51,16.01 JP3.1
M66_DBG_TX
  Top 0.152: U1.39 23.03,23.42 25.33,21.12 25.33,19.92 26.7,18.55 JP3.2
M66_RX
  Top 0.152: JP2.2 23.63,40.18 23.63,34.02 13.03,23.42 6.97,23.42 5.87,24.52 U1.18
M66_TX
  Top 0.152: U1.17 4.35,25.6 2.93,25.6 2.43,25.1 2.43,19.42 3.13,18.72 5.33,18.72 7.13,20.52 7.13,22.32 7.53,22.72 13.23,22.72 25.98,35.47 JP1.2
N$1
  Top 0.152: Q1.3 70.31,17.24 LS1.2
N$2
  Top 0.152: R7.1 11.16,64.05 U4.2
N$3
  Top 0.813: R8.2 14.43,41.22 14.83,41.62 14.83,42.72 14.31,43.24 U5.1
N$4
  Top 0.152: R9.2 28.54,48.75 U$5.P$5
N$5
  Top 0.152: U6.3 12.12,46.15 12.75,46.15 13.16,45.74 U5.2
N$6  (via drill 0.35)
  Top 0.152: v21.23,47.62 21.19,47.66 U$5.P$4 | R10.1 20.49,42.08 21.23,42.82 v21.23,42.92
  Bottom 0.152: v21.23,47.62 v21.23,42.92
N$7  (via drill 0.35)  (4 unrouted)
  other vias: 8.36,14.74 8.36,13.92 8.36,13.1 8.36,12.28 8.36,11.46
N$8  (via drill 0.35)  (4 unrouted)
  other vias: 10.99,14.74 10.99,13.92 10.99,13.1 10.99,12.28 10.99,11.46
N$9  (via drill 0.35)  (4 unrouted)
  other vias: 18.22,14.54 18.22,13.72 18.22,12.9 18.22,12.08 18.22,11.26
N$10  (via drill 0.35)  (4 unrouted)
  other vias: 18.22,10.34 18.22,9.52 18.22,8.7 18.22,7.88 18.22,7.06
N$11  (via drill 0.35)
  other vias: 18.22,6.14
N$12  (via drill 0.35)  (4 unrouted)
  other vias: 20.89,14.51 20.89,13.69 20.89,12.87 20.89,12.05 20.89,11.23
N$13  (via drill 0.35)  (4 unrouted)
  other vias: 20.89,10.31 20.89,9.49 20.89,8.67 20.89,7.85 20.89,7.03
N$14  (via drill 0.35)
  other vias: 20.89,6.11
N$28  (via drill 0.35)
  Top 0.813: U2.2 v29.23,61.12 | v49.83,57.62 50.43,58.22 50.43,66.8 U$3.P$1
  Bottom 0.813: v29.23,61.12 29.23,60.54 D1.C 48.18,55.97 v49.83,57.62
N$29
  Top 0.152: R1.2 18.12,37.66 R2.2 15.93,37.62 15.93,36.42 15.53,36.02 12.63,36.02 12.03,36.62 12.03,37.58 T1.1
N$30
  Top 0.152: LED1.A 2.35,45.81 R3.1
N$33
  Top 0.152: R4.2 51.04,23.07 SJ2.3
NETLIGHT
  Top 0.152: R3.2 4.55,44.06 7.33,41.28 7.33,38.92 1.73,33.32 1.73,27.32 2.33,26.72 U1.16
NRST  (via drill 0.35)
  Top 0.152: U$1.7 40.58,33.11 41.28,33.81 42.28,33.81 43.53,35.06 43.53,36.42 v43.83,36.72
  Bottom 0.152: v43.83,36.72 50.13,36.72 54.03,32.82 54.03,9.41 56.75,6.69 57.85,6.69 58.75,5.79 JP4.5
PIEZO
  Top 0.152: U$1.43 47.76,28.39 49.03,27.12 49.03,20.42 49.73,19.72 60.53,19.72 61.46,18.79 Q1.1
PWRKEY
  Top 0.152: T1.3 10.97,35.37 12.97,33.37 U1.7
PWRKEY_ST  (via drill 0.35)
  Top 0.152: U$1.38 46.36,25.89 46.74,25.51 v46.74,24.32 v46.73,24.32 | v22.63,37.62 20.1,37.62 R1.1
  Bottom 0.152: v46.73,24.32 46.13,23.72 36.73,23.72 22.83,37.62 v22.63,37.62
RF_ANT
  Top 1.016: U1.35 ANT1.SIG
ROW0
  Top 0.152: U$1.28 39.58,13.47 38.06,11.95 34.46,11.95 33.46,10.95 JP5.7
ROW1
  Top 0.152: JP5.6 36,11.39 36.23,11.62 38.43,11.62 40.08,13.27 U$1.29
ROW2
  Top 0.152: JP5.5 38.54,11.03 40.58,13.07 U$1.30
ROW3
  Top 0.152: JP5.4 U$1.31
SENS0  (via drill 0.35)
  Top 0.152: U$1.11 38.58,33.27 37.63,34.22 v37.63,34.62
  Bottom 0.152: v37.63,34.62 52.73,49.72 60.63,49.72 J2.2
SENS1  (via drill 0.35)
  Top 0.152: U$1.14 34.46,30.39 v32.73,32.12
  Bottom 0.152: v32.73,32.12 32.13,32.72 32.13,35.52 33.03,36.42 36.33,36.42 46.33,46.42 46.33,49.32 47.13,50.12 64.53,50.12 67.33,47.32 67.33,43.32 66.31,42.3 J2.3
SENS2  (via drill 0.35)
  Top 0.152: U$1.15 33.96,29.89 v31.53,32.32
  Bottom 0.152: v31.53,32.32 31.53,32.62 31.73,32.82 31.73,35.62 32.93,36.82 36.13,36.82 45.93,46.62 45.93,49.72 46.73,50.52 64.63,50.52 67.73,47.42 67.73,43.22 65.93,41.42 65.93,37.72 64.81,36.6 J2.4
SENS3  (via drill 0.35)
  Top 0.152: U$1.16 33.46,29.39 v30.23,32.62
  Bottom 0.152: v30.23,32.62 30.23,32.92 31.33,34.02 31.33,35.72 32.82,37.21 36.02,37.21 45.53,46.72 45.53,50.12 46.33,50.92 64.73,50.92 68.13,47.52 68.13,43.12 66.33,41.32 66.33,32.72 64.51,30.9 J2.5
SENS4  (via drill 0.35)
  Top 0.152: U$1.17 33.06,28.89 29.13,32.82 29.13,33.22 v29.73,33.82
  Bottom 0.152: v29.73,33.82 30.63,33.82 30.93,34.12 30.93,35.82 32.63,37.52 35.83,37.52 45.13,46.82 45.13,50.32 46.13,51.32 64.83,51.32 68.53,47.62 68.53,43.02 66.73,41.22 66.73,27.62 64.31,25.2 J2.6
SENS5  (via drill 0.35)
  Top 0.152: U$1.18 32.86,28.39 28.53,32.72 v28.53,33.72 | v27.43,35.82 27.43,36.32 28.06,36.94 28.75,36.94 32.79,40.99 32.79,42.56 35.55,45.32 v35.93,45.32
  Bottom 0.152: v28.53,33.72 28.53,34.72 v27.43,35.82 | v35.93,45.32 43.03,45.32 44.73,47.02 44.73,50.55 45.8,51.62 65.02,51.62 68.93,47.72 68.93,42.72 67.03,40.82 67.03,27.49 62.66,23.12 61.73,23.12 59.83,25.02 59.83,45.72 57.55,48 J2.8
SENS6  (via drill 0.35)
  Top 0.152: U$1.19 32.36,27.89 31.13,29.12 28.83,31.42 v27.83,31.42
  Bottom 0.152: v27.83,31.42 22.63,36.62 22.23,36.62 21.63,37.22 21.63,40.62 27.13,46.12 36.33,46.12 36.63,45.82 36.63,45.72 42.93,45.72 44.33,47.12 44.33,50.62 45.73,52.02 65.13,52.02 69.33,47.82 69.33,42.52 67.34,40.53 67.34,27.36 62.79,22.81 61.6,22.81 59.52,24.89 59.52,41.42 58.63,42.32 56.87,42.32 J2.9
SENS7  (via drill 0.35)
  Top 0.152: U$1.20 31.76,27.39 29.83,29.32 29.83,29.82 28.93,30.72 28.53,30.72 28.23,30.42 v27.83,30.42
  Bottom 0.152: J2.10 58.15,36.6 59.13,35.62 59.13,24.82 61.53,22.42 62.94,22.42 67.64,27.12 67.64,40.33 69.73,42.42 69.73,47.92 65.83,51.82 65.83,54.22 64.23,55.82 56.23,55.82 54.73,54.32 54.73,52.92 54.23,52.42 45.6,52.42 44.02,50.84 44.02,47.24 42.81,46.03 36.84,46.03 36.45,46.42 26.9,46.42 21.32,40.84 21.32,37.09 22.1,36.31 22.5,36.31 27.22,31.59 27.22,31.02 v27.83,30.42
SENS8  (via drill 0.35)
  Top 0.152: U$1.21 26.56,26.89 v26.33,27.12
  Bottom 0.152: v26.33,27.12 20.43,33.02 20.43,37.42 20.93,37.92 20.93,40.92 26.83,46.82 36.73,46.82 37.13,46.42 42.53,46.42 43.63,47.52 43.63,50.92 45.43,52.72 54.03,52.72 54.33,53.02 54.33,54.42 56.03,56.12 64.42,56.12 66.23,54.32 66.23,51.85 70.03,48.04 70.03,42.22 68.03,40.22 68.03,28.62 68.63,28.02 70.83,28.02 72.33,26.52 72.33,23.92 70.93,22.52 68.43,22.52 66.72,24.22 65.33,24.22 63.13,22.02 61.33,22.02 58.73,24.62 58.73,30.02 57.85,30.9 J2.11
SENS9  (via drill 0.35)
  Top 0.152: U$1.22 35.76,26.39 35.64,26.51 28.42,26.51 27.73,25.82 26.03,25.82 v24.93,26.92
  Bottom 0.152: v24.93,26.92 24.93,28.02 20.03,32.92 20.03,37.62 20.53,38.12 20.53,41.02 26.73,47.22 36.83,47.22 37.32,46.72 42.4,46.72 43.32,47.64 43.32,51.04 45.31,53.03 53.83,53.03 54.02,53.22 54.02,54.54 55.91,56.43 64.55,56.43 66.54,54.43 66.54,52 70.43,48.12 70.43,42.02 68.43,40.02 68.43,28.82 68.83,28.42 70.93,28.42 72.73,26.62 72.73,23.82 71.12,22.21 68.3,22.21 66.6,23.92 65.63,23.92 63.33,21.62 61.23,21.62 57.65,25.2 J2.12
SIM_CLK  (via drill 0.35)
  Top 0.152: U1.13 6.37,29.78 8.03,28.12 v8.93,28.12
  Bottom 0.152: v8.93,28.12 11.34,25.71 J1.C3
SIM_DATA  (via drill 0.35)
  Top 0.152: U1.11 8.57,29.58 10.33,27.82 10.33,25.62 9.62,24.91 7.78,24.91 7.77,24.92 7.53,24.92 v6.73,25.72
  Bottom 0.152: v6.73,25.72 v6.72,25.71 J1.C7
SIM_GND  (via drill 0.35)
  Top 0.152: U1.10 9.67,29.78 11.33,28.12 11.33,25.59 9.85,24.11 8.04,24.11 v8.03,24.12
  Bottom 0.152: v8.03,24.12 7.03,23.12 7.03,21.02 6.64,20.63 J1.C5
SIM_RST  (via drill 0.35)
  Top 0.152: U1.12 7.47,30.58 7.43,30.62 v7.43,29.72
  Bottom 0.152: v7.43,29.72 7.73,29.42 7.73,27.12 11.68,23.17 J1.C2
SIM_VDD  (via drill 0.35)
  Top 0.152: v2.73,30.12 2.73,29.12 2.93,28.92 U1.14 6.33,28.92 8.03,27.22 v8.03,25.52
  Bottom 0.152: SJ1.1 3.65,34.33 3.65,34.14 2.73,33.22 v2.73,30.12 | v8.03,25.52 12.92,20.63 J1.C1
SIM_VPP
  Bottom 0.152: SJ1.2 1.63,33.83 1.63,24.12 2.63,23.12 5.13,23.12 J1.C6
SPI1_CS
  Top 0.152: U$1.42 47.76,27.89 48.63,27.02 48.63,18.22 53.23,13.62 53.23,9.82 54.03,9.02 65.33,9.02 65.73,9.41 65.73,10.72 69.23,14.22 72.03,14.22 74.43,16.62 74.43,33.52 69.13,38.82 56.83,38.82 54.06,41.58 U3.1
SPI1_MISO  (via drill 0.35)
  Top 0.152: U$1.40 47.36,26.89 47.83,26.42 47.83,18.02 52.43,13.42 52.43,9.62 53.83,8.22 65.63,8.22 66.63,9.22 66.63,10.52 69.53,13.42 72.23,13.42 75.23,16.42 75.23,33.82 65.23,43.82 65.23,44.22 v64.33,45.12 | U3.2 53.56,42.85 54.73,44.02 61.93,44.02 v62.33,44.42
  Bottom 0.152: v62.33,44.42 63.03,45.12 v64.33,45.12
SPI1_MOSI
  Top 0.152: U$1.41 47.76,27.39 48.23,26.92 48.23,18.12 52.83,13.52 52.83,9.72 53.93,8.62 65.56,8.62 66.13,9.18 66.13,10.62 69.33,13.82 72.13,13.82 74.83,16.52 74.83,33.72 63.13,45.42 54.23,45.42 52.83,46.82 45.73,46.82 45.03,46.12 U3.5
SPI1_SCK
  Top 0.152: U$1.39 47.06,26.39 47.43,26.02 47.43,17.82 52.03,13.22 52.03,9.52 53.72,7.82 65.83,7.82 67.13,9.12 67.13,10.52 69.63,13.02 72.33,13.02 75.63,16.32 75.63,33.92 65.63,43.92 65.63,45.02 64.73,45.92 54.33,45.92 53.03,47.22 45.13,47.22 43.63,45.72 43.63,44.82 44.32,44.12 U3.6
SWCLK  (via drill 0.35)
  Top 0.152: U$1.37 45.76,25.39 45.93,25.22 v45.93,22.42
  Bottom 0.152: v45.93,22.42 45.93,18.32 51.13,13.12 JP4.2
SWDIO  (via drill 0.35)
  Top 0.152: U$1.34 42.58,17.47 v42.53,17.42 | v50.13,6.92 51.13,5.92 56.13,5.92 56.21,5.84 JP4.4
  Bottom 0.152: v42.53,17.42 42.53,15.12 44.63,13.02 47.83,13.02 50.23,10.62 50.23,7.02 v50.13,6.92
THIN  (via drill 0.35)
  Top 0.152: U$5.P$6 27.23,50.02 28.33,51.12 v28.43,51.12 | v21.93,54.12 18.13,54.12 15.73,56.52 8.92,56.52 6.93,58.51 6.93,61.71 J4.2
  Bottom 0.152: v28.43,51.12 28.43,52.42 26.73,54.12 v21.93,54.12
USART2_RX  (via drill 0.35)
  Top 0.152: U$1.13 35.16,30.89 33.03,33.02 32.13,33.02 v30.03,35.12
  Bottom 0.152: v30.03,35.12 28.52,36.63 JP1.1
USART2_TX  (via drill 0.35)
  Top 0.152: U$1.12 38.08,32.97 36.03,35.02 36.03,38.42 35.53,38.92 v34.13,38.92
  Bottom 0.152: JP2.1 29.05,42.5 32.63,38.92 v34.13,38.92
USB_DM  (via drill 0.35)
  Top 0.152: U$1.32 41.48,23.87 41.48,15.67 43.33,13.82 v45.71,13.82 v45.72,13.82 | v48.03,13.82 48.03,13.52 50.73,10.82 50.73,8.92 53.23,6.42 66.73,6.42 68.73,8.42 68.73,9.98 70.66,11.92 73.73,11.92 77.43,15.62 77.43,34.02 66.73,44.72 66.73,56.62 70.73,60.62 70.73,63.32 69.48,64.57 64.18,64.57 62.23,62.62 62.23,61.32 61.45,60.54 X1.2
  Bottom 0.152: v48.03,13.82 v48.02,13.82 v45.72,13.82
USB_DP  (via drill 0.35)
  Top 0.152: U$1.33 42.08,17.83 41.92,17.67 41.92,15.92 43.33,14.52 v44.53,14.52 | v47.43,15.42 47.73,15.42 51.13,12.02 51.13,9.12 53.43,6.82 66.53,6.82 68.33,8.62 68.33,10.02 70.63,12.32 73.63,12.32 77.03,15.72 77.03,33.82 66.33,44.52 66.33,56.72 65.43,57.62 64.13,57.62 63.45,58.3 X1.3
  Bottom 0.152: v47.43,15.42 45.43,15.42 v44.53,14.52
VBAT  (via drill 0.35)
  Top 0.152: TP1.TP 8.55,69 C18.1
  Top 0.813: J4.1 7.54,66.41 | 7.54,66.41 9.89,64.05 U4.3 | 7.54,66.41 11.03,66.41 | 11.03,66.41 13.42,66.41 13.87,65.96 R7.2 13.87,61.46 v13.83,61.42 12.43,60.02 U4.1 | U$5.P$1 17.29,52.56 v14.73,55.12 | C18.1 11.03,66.41
  Bottom 0.813: v14.73,55.12 14.73,60.52 v13.83,61.42
VBAT_5V
  Top 0.152: 15.67,47.56 17.23,49.12 TP2.TP
  Top 0.508: 15.16,47.05 U6.4
  Top 0.813: 15.16,47.05 15.67,47.56 15.64,51.2 13.99,52.85 12.63,52.85 12.43,53.05 U4.8
VIN  (via drill 0.35)
  Top 0.152: C1.1 22.77,63.12 26.73,63.12 U2.1 | 13.76,48.82 U6.6
  Top 0.813: U6.6 13.76,50.75 | 13.76,50.75 v13.83,50.82 | U2.1 v27.53,60.62 30.13,58.02 35.37,58.02 D2.C 47.6,53.39 v49.03,54.82 | U6.2 U6.1 13.04,50.75 13.76,50.75 | U6.5 13.76,48.82 | v59.23,57.62 62.35,54.5 J2.1
  Bottom 0.813: v13.83,50.82 23.63,60.62 v27.53,60.62 | v49.03,54.82 52.73,54.82 55.73,57.82 59.03,57.82 v59.23,57.62
WP  (via drill 0.35)
  Top 0.152: U$1.10 39.08,33.27 38.93,33.42 v38.93,34.22 | v54.03,44.72 54.03,44.42 53.73,44.12 U3.3
  Bottom 0.152: v38.93,34.22 49.73,45.02 53.73,45.02 v54.03,44.72

### Text on the board
tPlace: HomeAlarm_revB